# EAGLE design Display-KeyboardModule_v8 (EAGLE 9.6.2)
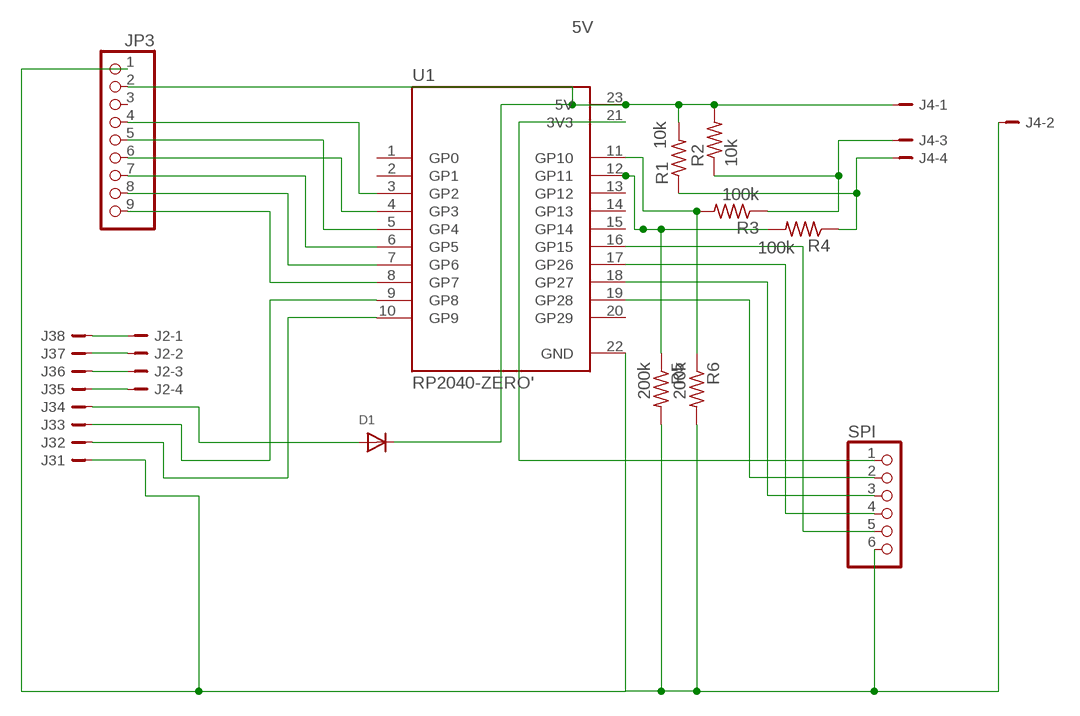
[diagram p0: schematic, sheet 1]

## Parts
D1  DIODESMA  [SMADIODE]
J2  JST-PH-4_TH-RA  [S4B-PH-KL]
J3  B8B-PH-K-S  [B8B-PH-K-S]
J4  JST-PH-4_TH-RA  [S4B-PH-KL]
JP3  PINHD-1X9  [1X09-BIG]
R1  10k  R-US_R1206  [R1206]
R2  10k  R-US_R1206  [R1206]
R3  100k  R-US_R1206  [R1206]
R4  100k  R-US_R1206  [R1206]
R5  200k  R-US_R1206  [R1206]
R6  200k  R-US_R1206  [R1206]
SPI  PINHD-1X6  [1X06]
U1  RP2040-ZERO'  [MODULE_RP2040-ZERO]

## Nets
5V: D1.C J4.1 JP3.2 R1.2 R2.2 U1.23(5V)
GND: J3.1 J4.2 JP3.1 R5.2 R6.2 SPI.6 U1.22(GND)
N$1: D1.A J3.4
N$2: J2.1 J3.8
N$3: JP3.4 U1.3(GP2)
N$4: J3.3 U1.9(GP8)
N$5: J3.2 U1.10(GP9)
N$6: JP3.6 U1.4(GP3)
N$7: JP3.5 U1.5(GP4)
N$8: JP3.7 U1.6(GP5)
N$9: JP3.8 U1.7(GP6)
N$10: JP3.9 U1.8(GP7)
N$11: SPI.2 U1.19(GP28)
N$12: J4.3 R2.1 R3.1
N$13: J2.2 J3.7
N$14: J2.3 J3.6
N$15: J2.4 J3.5
N$16: SPI.3 U1.18(GP27)
N$17: J4.4 R1.1 R4.1
N$18: SPI.4 U1.17(GP26)
N$20: R3.2 R6.1 U1.11(GP10)
N$21: SPI.5 U1.16(GP15)
N$22: SPI.1 U1.21(3V3)
N$23: R4.2 R5.1 U1.12(GP11)
Unconnected: JP3.3 U1.1(GP0) U1.2(GP1) U1.13(GP12) U1.14(GP13) U1.15(GP14) U1.20(GP29)

## Library data of the parts
D1 = adafruit:DIODE: Diode SMADIODE - SMA Surface Mount Package 20V 1A Schottky Diode Digikey: 641-1014-6-ND DO-1N4148 - Through Hole Small Current Diode SOD-123 20V 1 A (.5mV Vf) Schottky Diode - Digikey: MBRX120TPMSCT-ND SOD-323 10V 570mA (.38mV Vf, 3ns) Schottky Diode - Digikey: ZLLS410CT-ND SOD-523 30V 30mA Schottky Diode (RB751S-40TE61) - Digikey: RB751S-40TE61CT-ND SOT23-R/W - SOT23 Package (R = Solder Paste/Reflow Ovens, W = Hand-Soldering) BAT54Film 40V 300mA - Digikey: 497-7162-1-ND
J2 J4 = con-JST-PH:JST-PH-4; MF: JST; MPN: S4B-PH-KL
J3 = con-JST-PH:B8B-PH-K-S: JST-PH 8-way vertical TH
JP3 = adafruit:PINHD-1X9: Pin header 1x10 0.1" spacing With round pins
R1-R6 = adafruit:R-US_: RESISTOR, American symbol
SPI = adafruit:PINHD-1X6: PIN HEADER
U1 = RP2040-ZERO:RP2040-ZERO: Check availability <https://pricing.snapeda.com/parts/RP2040-ZERO/Waveshare%20Electronics/view-part?ref=eda>; AVAILABILITY: Not in stock; CHECK_PRICES: https://www.snapeda.com/parts/RP2040-ZERO/Waveshare+Electronics/view-part/?ref=eda; DESCRIPTION: Low-Cost, High-Performance Pico-Like MCU Board Based On Raspberry Pi Microcontroller RP2040; MF: Waveshare Electronics; MP: RP2040-ZERO; PACKAGE: Package; PRICE: None; SNAPEDA_LINK: https://www.snapeda.com/parts/RP2040-ZERO/Waveshare+Electronics/view-part/?ref=snap

## Board
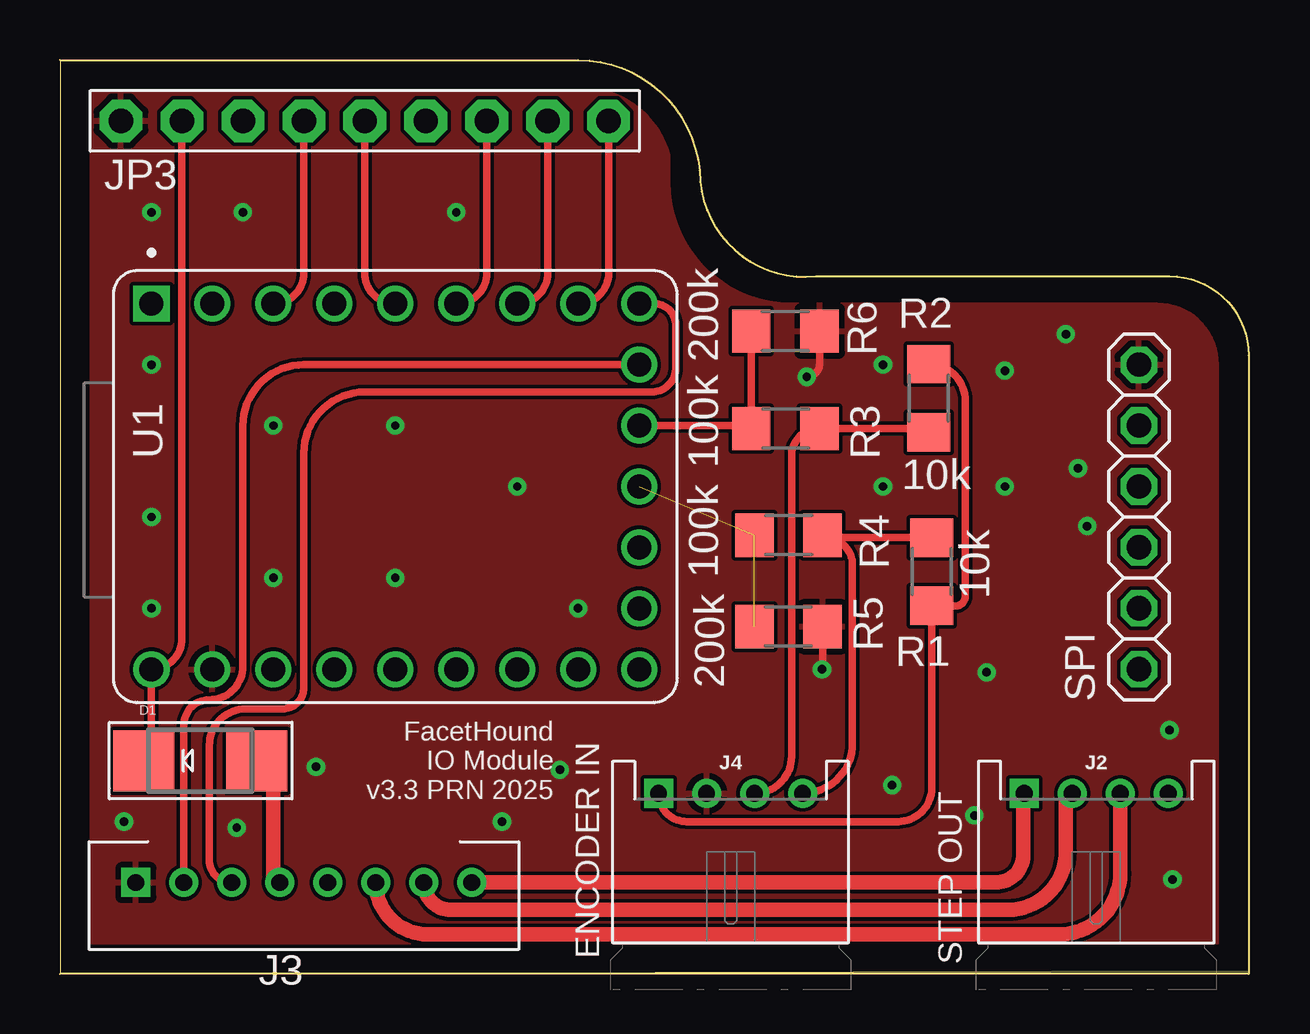
[diagram p1: board, top side]
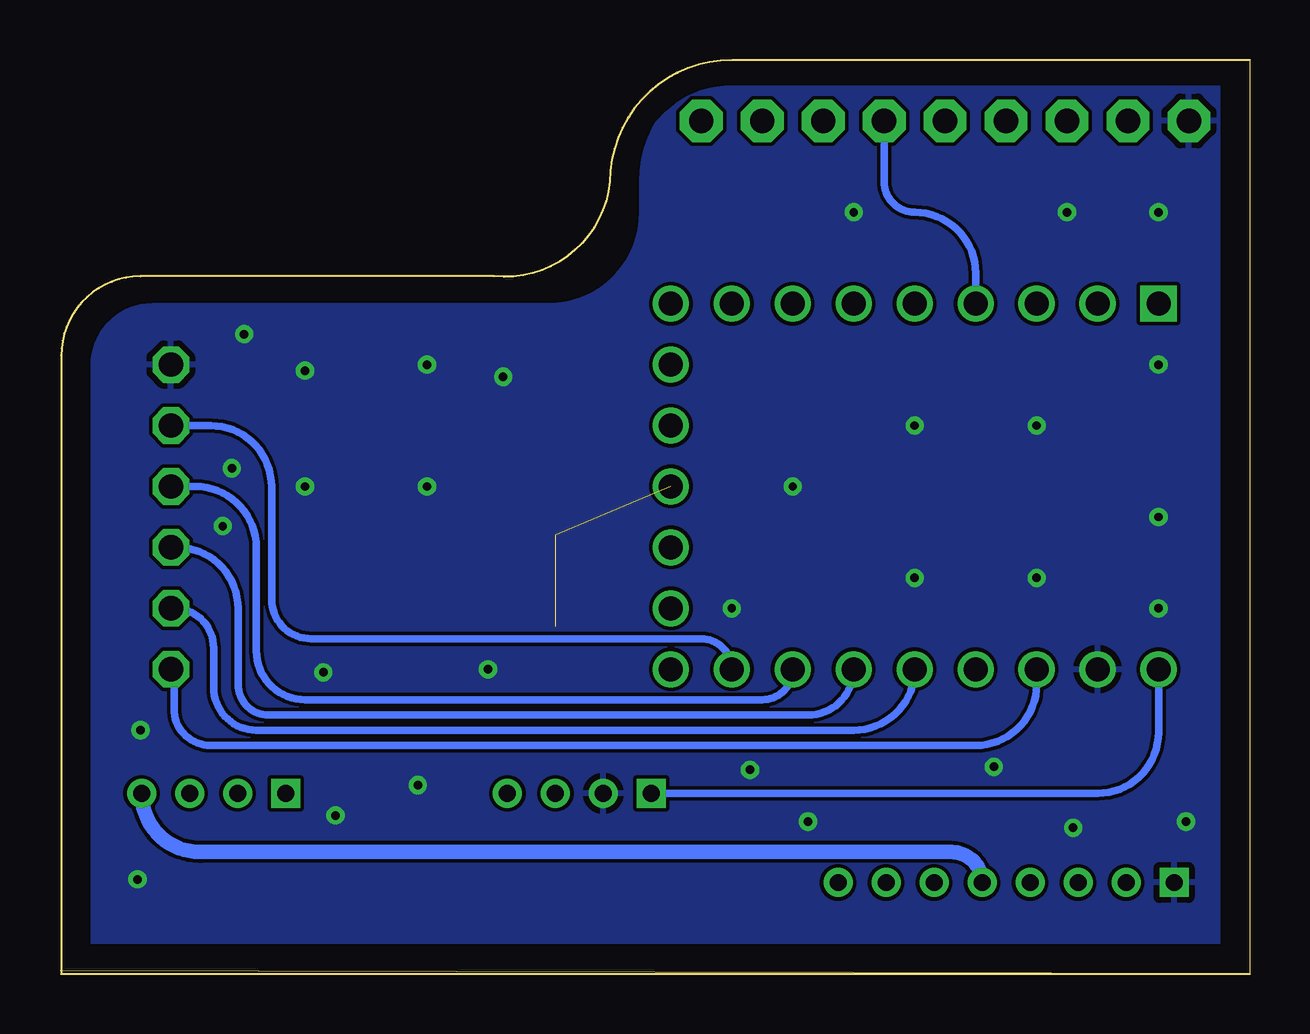
[diagram p2: board, bottom side, seen from below]

Size 49.58 x 38.1 mm. Coordinates in mm from the lower left corner, seen from the top.
Outline: 0,0 49.58,0.13
Outline: 0,38.09 0,0
Outline: 0,0 49.53,0 49.53,25.78 arc90 46.23,29.08 31.5,29.08 arc-90 26.67,33.02 arc90 21.59,38.1 0,38.1
Copper layers (1*16): Top 0.035mm / dielectric 1.5mm / Bottom 0.035mm
Design rules "default": minimum track width 6mil, minimum drill 0.35mm, track to track 6mil, track to pad 6mil, pad to pad 6mil, via to via 6mil, smd to smd 6mil, copper to edge 40mil, drill to drill 6mil, minimum pad ring 10mil, minimum via ring 8mil, stop-mask expansion 4mil, vias tented up to drill 0mil, thermal gap 10mil

### Footprints (pad centres in the part's own frame; a part is rotated, then mirrored left to right if it is on the bottom)
SMADIODE = smd 2.54 x 2.54: A 2.349,0; C -2.349,0
S4B-PH-KL = drill 0.7 square: 1 3,-3.72 | drill 0.7: 2 1,-3.72; 3 -1,-3.72; 4 -3,-3.72
B8B-PH-K-S = drill 0.7 square: 1 7,0 | drill 0.7: 2 5,0; 3 3,0; 4 1,0; 5 -1,0; 6 -3,0; 7 -5,0; 8 -7,0
1X09-BIG = drill 1.016 pad 1.778 octagon: 1 -10.16,0; 2 -7.62,0; 3 -5.08,0; 4 -2.54,0; 5 0,0; 6 2.54,0; 7 5.08,0; 8 7.62,0; 9 10.16,0
R1206 = smd 1.6 x 1.803: 1 -1.422,0; 2 1.422,0
1X06 = drill 1.016 octagon: 1 -6.35,0; 2 -3.81,0; 3 -1.27,0; 4 1.27,0; 5 3.81,0; 6 6.35,0
MODULE_RP2040-ZERO = drill 1 square: 1 7.62,10.16 | drill 1: 2 7.62,7.62; 3 7.62,5.08; 4 7.62,2.54; 5 7.62,0; 6 7.62,-2.54; 7 7.62,-5.08; 8 7.62,-7.62; 9 7.62,-10.16; 10 5.08,-10.16; 11 2.54,-10.16; 12 0,-10.16; 13 -2.54,-10.16; 14 -5.08,-10.16; 15 -7.62,-10.16; 16 -7.62,-7.62; 17 -7.62,-5.08; 18 -7.62,-2.54; 19 -7.62,0; 20 -7.62,2.54; 21 -7.62,5.08; 22 -7.62,7.62; 23 -7.62,10.16

### Placement (x,y rotation side)
D1  5.84,8.89 0 top
J2  43.18,3.81 180 top
J3  10.16,3.81 180 top
J4  27.94,3.81 180 top
JP3  12.7,35.56 0 top
R1  36.32,16.76 270 top
R2  36.2,24 90 top
R3  30.23,22.73 180 top
R4  30.35,18.29 180 top
R5  30.35,14.48 0 top
R6  30.23,26.8 0 top
SPI  44.96,19.05 90 top
U1  13.97,20.32 90 top

### Tracks (layer width: path | path; a pad name or v marks a point on that pad's centre or on a via)
5V
  Top 0.305: JP3.2 5.08,13.97 arc-90 U1.23 3.81,9.21 arc-90 D1.C | R2.2 arc-90 37.72,23.9 37.72,15.75 arc-90 37.31,15.34 R1.2 36.32,7.75 arc-90 34.92,6.35 26.12,6.35 arc-90 J4.1
  Top 0.61: 3.81,9.21 D1.C
  Bottom 0.305: U1.23 3.81,10.07 arc90 6.35,7.53 J4.1
GND  (via drill 0.35)
  Top 0.305: R6.2 31.65,25.43 arc-90 v31.11,24.89 | R5.2 31.78,12.72 arc-90 v31.75,12.7
  other vias: 3.81,15.24 3.81,19.05 3.81,25.4 3.81,31.75 7.62,31.75 16.51,31.75 13.97,22.86 8.89,22.86 8.89,16.51 13.97,16.51 19.05,20.32 21.59,15.24 34.29,20.32 34.29,25.4 41.91,26.67 39.37,20.32 39.37,25.15 42.42,21.08 42.8,18.67 38.61,12.57 46.23,10.16 34.67,7.87 38.1,6.6 46.35,3.94 20.83,8.51 18.41,6.35 7.37,6.1 2.67,6.35 10.67,8.64
  pour Bottom: 1.27,38.1 1.27,1.27 48.26,1.27 48.26,25.4 arc90 45.72,27.94 29.21,27.94 arc-90 25.4,31.75 25.4,33.02 arc90 20.32,38.1
  pour Top: 1.27,36.83 1.27,1.27 48.26,1.27 48.26,25.4 arc90 45.72,27.94 30.48,27.94 arc-90 25.4,33.02 25.4,34.29 arc90 22.86,36.83
N$1
  Top 0.61: J3.4 8.89,4.08 8.89,8.89 D1.A
N$2
  Top 0.61: J3.8 38.99,3.81 arc90 40.13,4.95 40.13,7.48 arc-90 J2.1
N$3
  Top 0.305: U1.3 arc90 10.16,29.21 JP3.4
N$4
  Top 0.305: J3.3 arc-90 6.22,4.75 6.22,9.53 arc-90 7.75,11.05 9.27,11.05 arc90 10.16,11.94 10.16,21.72 arc-90 12.7,24.26 24.64,24.26 arc90 25.65,25.27 25.65,27.05 arc90 24.77,27.94 U1.9
N$5
  Top 0.305: J3.2 5.16,10.37 arc-90 6.22,11.43 arc90 7.62,12.83 7.62,22.86 arc-90 10.16,25.4 U1.10
N$6
  Bottom 0.305: U1.4 11.43,29.21 arc-90 13.97,31.75 arc90 15.24,33.02 JP3.6
N$7
  Top 0.305: U1.5 arc-90 12.7,29.21 JP3.5
N$8
  Top 0.305: U1.6 arc90 17.78,29.21 JP3.7
N$9
  Top 0.305: U1.7 arc90 20.32,29.21 JP3.8
N$10
  Top 0.305: U1.8 arc90 22.86,29.21 JP3.9
N$11
  Bottom 0.305: U1.19 arc90 16.51,10.16 41.4,10.16 arc90 43.18,11.94 43.18,13.59 arc-90 44.83,15.24 SPI.2
N$12
  Top 0.305: J4.3 arc90 30.48,9.07 30.48,21.59 arc-90 31.62,22.73 R3.1 36.04,22.73 arc-90 R2.1
N$13
  Top 0.61: J3.7 arc90 16.3,2.67 39.5,2.67 arc90 41.91,5.08 41.91,7.26 arc-90 J2.2
N$14
  Top 0.61: J3.6 arc90 15.32,1.65 41.64,1.65 arc90 44.18,4.19 J2.3
N$15
  Bottom 0.61: J3.5 arc-90 12.43,5.08 43.73,5.08 arc90 J2.4
N$16
  Bottom 0.305: U1.18 arc90 18.41,10.79 40.89,10.79 arc90 42.16,12.06 42.16,15.24 arc-90 44.7,17.78 SPI.3
N$17
  Top 0.305: R4.1 arc90 31.88,18.19 | 31.88,18.19 R1.1 | J4.4 arc90 33.02,9.61 33.02,17.04 arc90 31.88,18.19
N$18
  Bottom 0.305: U1.17 arc90 20.32,11.43 39.37,11.43 arc90 41.4,13.46 41.4,17.78 arc-90 43.94,20.32 SPI.4
N$20
  Top 0.305: U1.11 28.68,22.86 R3.2 R6.1
N$21
  Bottom 0.305: U1.16 arc-90 22.86,13.97 39.12,13.97 arc90 40.77,15.62 40.77,20.32 arc-90 43.31,22.86 SPI.5
N$22
  Bottom 0.305: U1.21 8.89,12.06 arc90 11.43,9.53 43.31,9.53 arc90 44.83,11.05 44.83,12.57 arc-90 SPI.1
N$23  (2 unrouted)

### Text on the board
tPlace: FacetHound / IO Module / v3.3 PRN 2025 | ENCODER IN
tNames: STEP OUT